# Altium project Proco RAT.PrjPcb
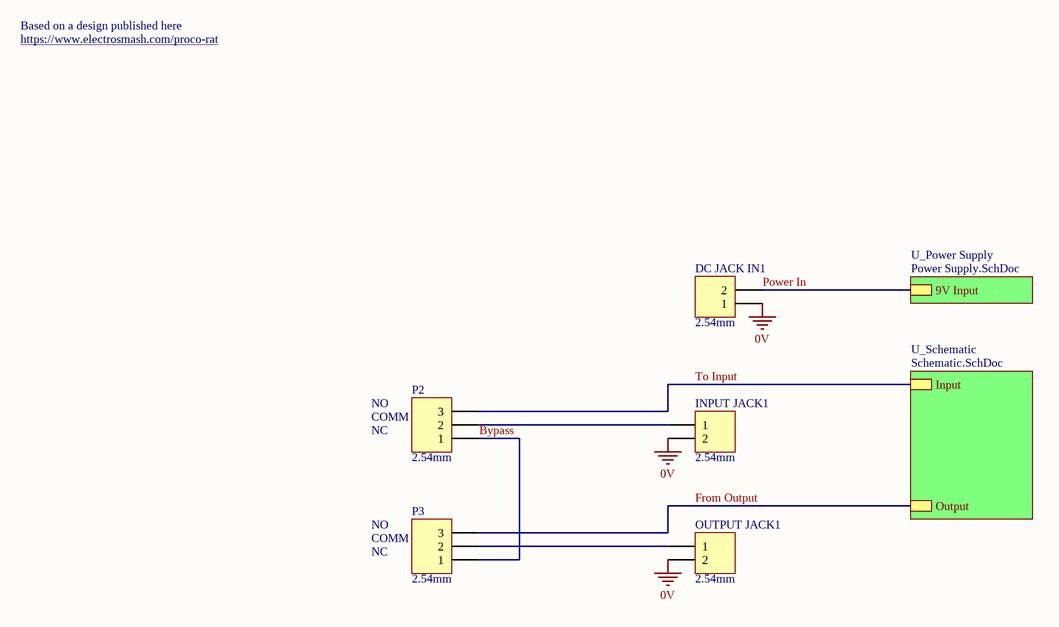
[diagram p0: Top Level.SchDoc]
3 sheets, 43 parts. Net scope: hierarchical (ports join the sheet entries above them; power ports are global).
Board file: PCB.PcbDoc
Sheets:
  Top Level.SchDoc
    U_Power Supply = Power Supply.SchDoc
    U_Schematic = Schematic.SchDoc

## Sheet Top Level.SchDoc
size A4

### Parts
DC_JACK_IN1  2.54mm  [TH 2.54mm Header 1x2]
INPUT_JACK1  2.54mm  [TH 2.54mm Header 1x2]
OUTPUT_JACK1  2.54mm  [TH 2.54mm Header 1x2]
P2  2.54mm  [TH 2.54mm Header 1x3]
P3  2.54mm  [TH 2.54mm Header 1x3]

### Sub-sheets
U_Power Supply = Power Supply.SchDoc: 9V Input
U_Schematic = Schematic.SchDoc: Output, Input

### Nets
0V: DC_JACK_IN1.1 INPUT_JACK1.2 OUTPUT_JACK1.2
Bypass: P2.1 P3.1
From Output: P3.3 ; sheet U_Schematic/Output
Power In: DC_JACK_IN1.2 ; sheet U_Power Supply/9V Input
To Input: P2.3 ; sheet U_Schematic/Input
NetINPUT_JACK1_1: INPUT_JACK1.1 P2.2
NetOUTPUT_JACK1_1: OUTPUT_JACK1.1 P3.2

### Notes on the sheet
- https://www.electrosmash.com/proco-rat
- Based on a design published here
- COMM
- NO
- NC

### Library data of the parts
DC_JACK_IN1 INPUT_JACK1 OUTPUT_JACK1 = TH 2.54mm Header 1x2: Positions: 2; Angle: 0; Flange: No; Contact: NA; Part Number: TH 2.54mm Header 1x2; Pitch: 2.54mm; Row Spacing: 2.54mm
P2 P3 = TH 2.54mm Header 1x3: Positions: 3; Angle: 0; Flange: No; Contact: NA; Part Number: TH 2.54mm Header 1x3; Pitch: 2.54mm; Row Spacing: 2.54mm

## Sheet Power Supply.SchDoc
size A4
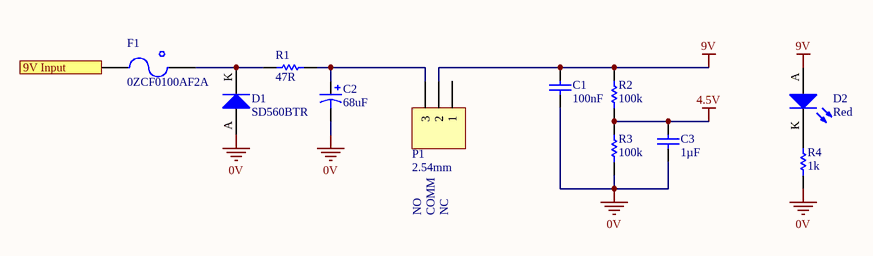
[diagram p1: Power Supply.SchDoc]

### Parts
C1  100nF  [0805]
C2  68uF  [2924]
C3  1µF  [0805]
D1  SD560BTR  [SMB Diode]
D2  Red  [0805 LED]
F1  0ZCF0100AF2A  [2920]
P1  2.54mm  [TH 2.54mm Header 1x3]
R1  47R  [2512]
R2  100k  [0805]
R3  100k  [0805]
R4  1k  [0805]

### Ports
9V Input

### Nets
0V: C1.2 C2.1 C3.1 D1.A R3.1 R4.1
4.5V: C3.2 R2.1 R3.2
9V: C1.1 D2.A P1.2 R2.2
Power In: F1.1 ; port 9V Input
NetC2_2: C2.2 P1.3 R1.2
NetD1_K: D1.K F1.2 R1.1
NetD2_K: D2.K R4.2

Not connected (* = marked no-connect by the designer): P1 1

### Notes on the sheet
- NO
- COMM
- NC

### Library data of the parts
C1 = GCM21BR71H104KA37L: Manufacturer: muRata; Tolerance: ±10%; Material: X7R; Rated Voltage: 50V; Part Number: GCM21BR71H104KA37L; Value: 100nF; Digikey Part Number: 490-6064-1-ND
C2 = TAJV686K035RNJ: Manufacturer: AVX Corporation; Tolerance: 10%; Material: Tantalum; Rated Voltage: 35V; Part Number: TAJV686K035RNJ; Value: 68uF; Digikey Part Number: 478-13135-1-ND
C3 = GCM21BR71H105KA03L: Manufacturer: muRata; Tolerance: ±10%; Material: X7R; Rated Voltage: 50V; Part Number: GCM21BR71H105KA03L; Value: 1µF; Digikey Part Number: 490-10675-1-ND
D1 = SD560BTR: 1.2V_F 600V 5A SMB; Manufacturer: SMC Diode Solutions; Part Number: SD560BTR; Digikey Part Number: 1655-1530-2-ND; Digikey Link: https://www.digikey.com/product-detail/en/smc-diode-solutions/SD560BTR/1655-1530-2-ND/6022620
D2 = SML-210LTT86: Red LED Indication - Discrete 1.75V 0805 (2012 Metric); Manufacturer: ROHM Semiconductor; Part Number: SML-210LTT86; Colour: Red; Digikey Part Number: 511-1286-1-ND; Digikey Link: https://www.digikey.com/product-detail/en/rohm-semiconductor/SML-210LTT86/511-1286-1-ND/637099
F1 = 0ZCF0100AF2A: PTC RESET FUSE 60V 1A 292; Manufacturer: Littelfuse Inc.; Part Number: 0ZCF0100AF2A; Digikey Part Number: 507-2070-1-ND; Digikey Link: https://www.digikey.com/product-detail/en/bel-fuse-inc/0ZCF0100AF2A/507-2070-1-ND/6210547
P1 = TH 2.54mm Header 1x3: as P2 on sheet Top Level; Part Number: TH 2.54mm Header 1x3; Pitch: 2.54mm; Row Spacing: 2.54mm
R1 = 352147RFT: Manufacturer: TE Connectivity; Tolerance: 0.01; Rated Voltage: 2W; Part Number: 352147RFT; Value: 47R; Digikey Part Number: A116000CT-ND
R2 R3 = RC0805FR07100KL: Manufacturer: YAGEO; Tolerance: 0.01; Rated Voltage: 0.125W; Part Number: RC0805FR07100KL; Value: 100k; Material: FR-07; Digikey Part Number: 311-100KCRCT-ND
R4 = RC0805FR071KL: Manufacturer: YAGEO; Tolerance: 0.01; Rated Voltage: 0.125W; Part Number: RC0805FR071KL; Value: 1k; Material: FR-07; Digikey Part Number: 311-1.00KCRCT-ND

## Sheet Schematic.SchDoc
size A4
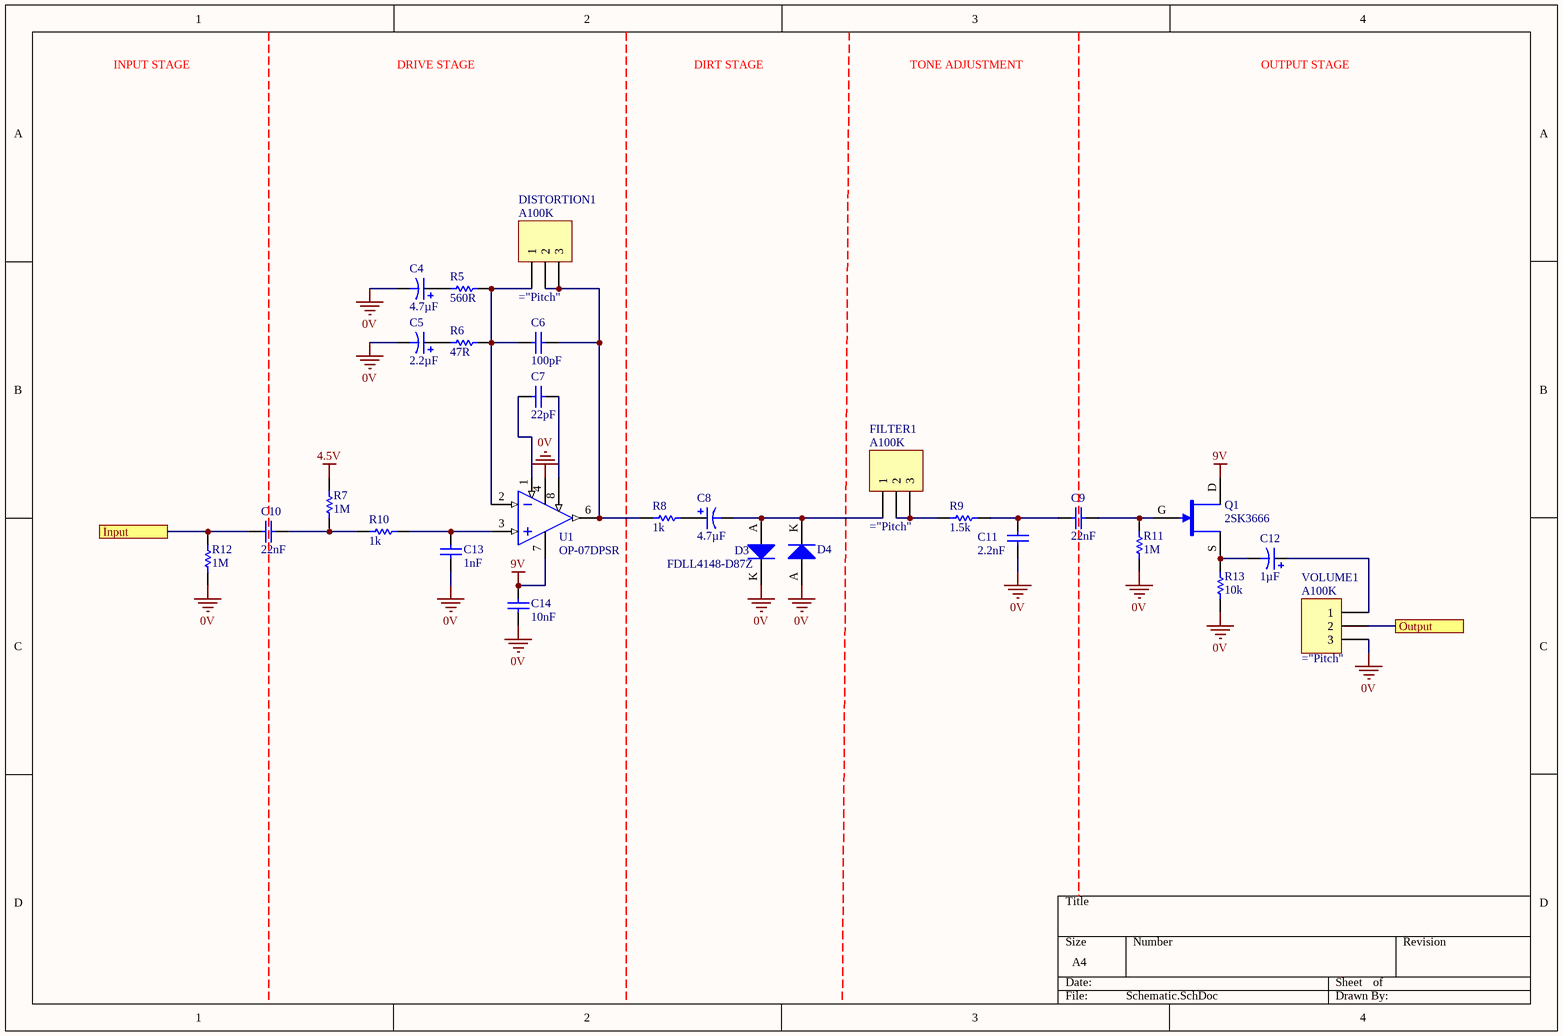
[diagram p2: Schematic.SchDoc]

### Parts
C4  4.7µF  [1206]
C5  2.2µF  [1206]
C6  100pF  [0805]
C7  22pF  [0805]
C8  4.7µF  [1206]
C9  22nF  [0805]
C10  22nF  [0805]
C11  2.2nF  [0805]
C12  1µF  [1206]
C13  1nF  [0805]
C14  10nF  [0805]
D3  FDLL4148-D87Z  [SOD-80 Diode]
D4  FDLL4148-D87Z  [SOD-80 Diode]  (value not drawn)
DISTORTION1  Resistance: A100K  [TH 2.54mm Header 1x3]
FILTER1  Resistance: A100K  [TH 2.54mm Header 1x3]
Q1  2SK3666  [ON SOT-23 JFET]
R5  560R  [0805]
R6  47R  [0805]
R7  1M  [0805]
R8  1k  [0805]
R9  1.5k  [0805]
R10  1k  [0805]
R11  1M  [0805]
R12  1M  [0805]
R13  10k  [0805]
U1  OP-07DPSR  [TI 8-SOIC]
VOLUME1  Resistance: A100K  [TH 2.54mm Header 1x3]

### Ports
Input, Output

### Nets
0V: C4.1 C5.1 C11.1 C13.1 C14.1 D3.K D4.A R11.1 R12.1 R13.1 U1.4(VCC-) VOLUME1.3
4.5V: R7.2
9V: C14.2 Q1.D U1.7(VCC+)
From Output: VOLUME1.2 ; port Output
To Input: C10.1 R12.2 ; port Input
NetC4_2: C4.2 R5.1
NetC5_2: C5.2 R6.1
NetC6_1: C6.1 DISTORTION1.1 R5.2 R6.2 U1.2(IN-)
NetC6_2: C6.2 DISTORTION1.2 DISTORTION1.3 R8.1 U1.6(OUT)
NetC7_1: C7.1 U1.1(OFFSET_N1)
NetC7_2: C7.2 U1.8(OFFSET_N2)
NetC8_1: C8.1 D3.A D4.K FILTER1.1
NetC8_2: C8.2 R8.2
NetC9_1: C9.1 C11.2 R9.2
NetC9_2: C9.2 Q1.G R11.2
NetC10_2: C10.2 R7.1 R10.1
NetC12_1: C12.1 Q1.S R13.2
NetC12_2: C12.2 VOLUME1.1
NetC13_2: C13.2 R10.2 U1.3(IN+)
NetFILTER1_2: FILTER1.2 FILTER1.3 R9.1

### Notes on the sheet
- INPUT STAGE
- DRIVE STAGE
- DIRT STAGE
- TONE ADJUSTMENT
- OUTPUT STAGE

### Library data of the parts
C4 C8 = TAJA475K025RNJ: Manufacturer: AVX Corporation; Tolerance: ±10%; Material: Tantalum; Rated Voltage: 25V; Part Number: TAJA475K025RNJ; Value: 4.7µF; Digikey Part Number: 478-11053-1-ND
C5 = TAJA225K025RNJ: Manufacturer: AVX Corporation; Tolerance: ±10%; Material: Tantalum; Rated Voltage: 25V; Part Number: TAJA225K025RNJ; Value: 2.2µF; Digikey Part Number: 478-1662-1-ND
C6 = GCM2165C1H101JA16D: Manufacturer: muRata; Tolerance: ±5%; Material: C0G, NP0; Rated Voltage: 50V; Part Number: GCM2165C1H101JA16D; Value: 100pF; Digikey Part Number: 490-8031-1-ND
C7 = GRM21A5C2E220JW01D: Manufacturer: muRata; Tolerance: ±5%; Material: C0G, NP0; Rated Voltage: 250V; Part Number: GRM21A5C2E220JW01D; Value: 22pF; Digikey Part Number: 490-5534-1-ND
C9 C10 = GCM21B5C1H223JA16L: Manufacturer: muRata; Tolerance: ±5%; Material: C0G, NP0; Rated Voltage: 50V; Part Number: GCM21B5C1H223JA16L; Value: 22nF; Digikey Part Number: 490-5318-1-ND
C11 = GCM2165C1H222JA16D: Manufacturer: muRata; Tolerance: ±5%; Material: C0G, NP0; Rated Voltage: 50V; Part Number: GCM2165C1H222JA16D; Value: 2.2nF; Digikey Part Number: 490-8033-1-ND
C12 = TAJA105K025RNJ: Manufacturer: AVX Corporation; Tolerance: ±10%; Material: Tantalum; Rated Voltage: 25V; Part Number: TAJA105K025RNJ; Value: 1µF; Digikey Part Number: 478-2363-1-ND
C13 = GCM2165C1H102JA16D: Manufacturer: muRata; Tolerance: ±5%; Material: C0G, NP0; Rated Voltage: 50V; Part Number: GCM2165C1H102JA16D; Value: 1nF; Digikey Part Number: 490-8032-1-ND
C14 = GCM2195C1H103JA16D: Manufacturer: muRata; Tolerance: ±5%; Material: C0G, NP0; Rated Voltage: 50V; Part Number: GCM2195C1H103JA16D; Value: 10nF; Digikey Part Number: 490-4783-1-ND
D3 D4 = FDLL4148-D87Z: DIODE GEN PURP 100V 200MA SOD80; Manufacturer: On Semiconductor; Part Number: FDLL4148-D87Z; Digikey Part Number: FDLL4148-D87ZCT-ND; Digikey Link: https://www.digikey.com/product-detail/en/on-semiconductor/FDLL4148-D87Z/FDLL4148-D87ZCT-ND/3042567
DISTORTION1 FILTER1 VOLUME1 = TH 2.54mm Header 1x3: Part Number: A100K POT; Positions: 3
Q1 = 2SK3666: JFET N-Channel 10mA 200mW Surface Mount 3-CP; Manufacturer: ON Semiconductor; Published: 24-Mar-1999; LatestRevisionDate: 29-May-2009; LatestRevisionNote: IPC-7351 Footprint Added.; PackageVersion: Sep-2000; PackageReference: SOT-343; Publisher: Altium Limited; PackageDescription: 4-Pin SOT-343 Package 1.3 mm Pitch, 2.1 mm Lead Span; Part Number: 2SK3666; Digikey Part Number: 869-1107-1-ND; Digikey Link: https://www.digikey.com/product-detail/en/on-semiconductor/2SK3666-3-TB-E/869-1107-1-ND/2165585
R5 = RC0805FR07560RL: Manufacturer: YAGEO; Tolerance: 0.01; Rated Voltage: 0.125W; Part Number: RC0805FR07560RL; Value: 560R; Material: FR-07; Digikey Part Number: 311-560CRCT-ND
R6 = RC0805FR0747RL: Manufacturer: YAGEO; Tolerance: 0.01; Rated Voltage: 0.125W; Part Number: RC0805FR0747RL; Value: 47R; Material: FR-07; Digikey Part Number: 311-47.0CRCT-ND
R7 R11 R12 = RC0805FR071ML: Manufacturer: YAGEO; Tolerance: 0.01; Rated Voltage: 0.125W; Part Number: RC0805FR071ML; Value: 1M; Material: FR-07; Digikey Part Number: 311-1.00MCRCT-ND
R8 R10 = RC0805FR071KL: as R4 on sheet Power Supply; Part Number: RC0805FR071KL; Value: 1k; Material: FR-07; Digikey Part Number: 311-1.00KCRCT-ND
R9 = RC0805FR071K5L: Manufacturer: YAGEO; Tolerance: 0.01; Rated Voltage: 0.125W; Part Number: RC0805FR071K5L; Value: 1.5k; Material: FR-07; Digikey Part Number: 311-1.50KCRCT-ND
R13 = RC0805FR0710KL: Manufacturer: YAGEO; Tolerance: 0.01; Rated Voltage: 0.125W; Part Number: RC0805FR0710KL; Value: 10k; Material: FR-07; Digikey Part Number: 311-10.0KCRCT-ND
U1 = OP-07DPSR: General Purpose Amplifier 1 Circuit 8-SO; Manufacturer: Texas Instruments; Part Number: OP-07DPSR; Digikey Part Number: 296-14171-2-ND; Digikey Link: https://www.digikey.com/product-detail/en/texas-instruments/OP-07DPSR/296-14171-2-ND/525998

## Nets that join several sheets
0V: Top Level (DC_JACK_IN1.1 INPUT_JACK1.2 OUTPUT_JACK1.2), Power Supply (6 pins), Schematic (12 pins)
4.5V: Power Supply (C3.2 R2.1 R3.2), Schematic (R7.2)
9V: Power Supply (C1.1 D2.A P1.2 R2.2), Schematic (C14.2 Q1.D U1.7)
From Output: Top Level (P3.3), Schematic (VOLUME1.2)
Power In: Top Level (DC_JACK_IN1.2), Power Supply (F1.1)
To Input: Top Level (P2.3), Schematic (C10.1 R12.2)